# Altium schematic sheet opa.SchDoc
size A3
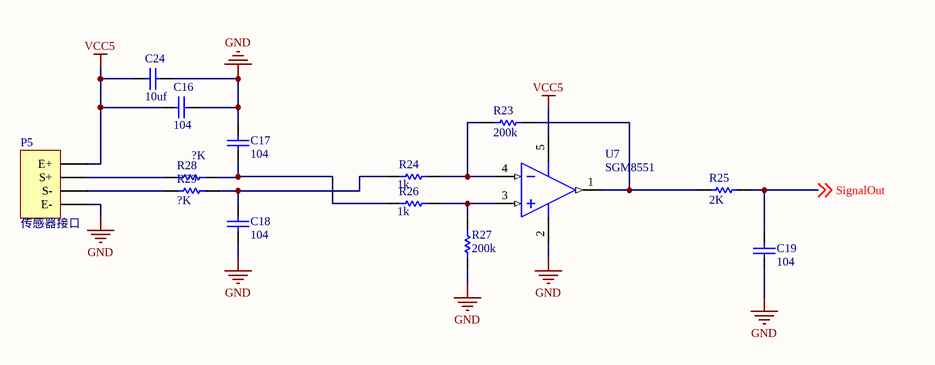
[diagram p0: opa.SchDoc]

## Parts
C16  value 104  [C0805]  (hidden comment: Cap)
C17  value 104  [C0805]  (hidden comment: Cap)
C18  value 104  [C0805]  (hidden comment: Cap)
C19  value 104  [C0805]  (hidden comment: Cap)
C24  value 10uf  [C0805]  (hidden comment: Cap)
P5  传感器接口  [HDR1X4]
R23  value 200k  [6-0805_N]  (hidden comment: Res1)
R24  value 1k  [6-0805_N]  (hidden comment: Res1)
R25  value 2K  [6-0805_N]  (hidden comment: Res1)
R26  value 1k  [6-0805_N]  (hidden comment: Res1)
R27  value 200k  [6-0805_N]  (hidden comment: Res1)
R28  value ?K  [6-0805_N]  (hidden comment: Res1)
R29  value ?K  [6-0805_N]  (hidden comment: Res1)
U7  SGM8551  [SOT23-5_N]

## Nets
GND: C16.1 C17.2 C18.1 C19.1 C24.1 P5.4(E-) R27.1 U7.2(VEE)
VCC5: C16.2 C24.2 P5.1(E+) U7.5(VCC)
SignalOut: C19.2 R25.1 ; off-sheet SignalOut
NetC17_1: C17.1 R26.1 R28.1
NetC18_2: C18.2 R24.1 R29.1
NetP5_2: P5.2(S+) R28.2
NetP5_3: P5.3(S-) R29.2
NetR23_1: R23.1 R25.2 U7.1(OUT)
NetR23_2: R23.2 R24.2 U7.4(IN-)
NetR26_2: R26.2 R27.2 U7.3(IN+)

## Library data of the parts
C16-C19 C24 = Cap: Capacitor; Published: 8-Jun-2000; LatestRevisionDate: 17-Jul-2002; LatestRevisionNote: Re-released for DXP Platform.; PackageReference: RAD-0.3; Publisher: Altium Limited; PackageDescription: Radial Cap, Thru-Hole; 2 Leads; 0.3 in Pin Spacing
P5 = Header 4: Header, 4-Pin; LatestRevisionDate: 17-Jul-2002; LatestRevisionNote: Re-released for DXP Platform.; Publisher: Altium Limited
R23-R29 = Res1: Resistor; Published: 8-Jun-2000; LatestRevisionDate: 17-Jul-2002; LatestRevisionNote: Re-released for DXP Platform.; PackageReference: AXIAL-0.3; Publisher: Altium Limited; PackageDescription: Axial Device, Thru-Hole; 2 Leads; 0.3 in Pin Spacing
U7 = MAX4214EUK-T: High-Speed, Single-Supply, Gain of +2, Closed-Loop, Rail-to-Rail Buffer with Enable; Published: 23-Sep-2002; LatestRevisionDate: 29-May-2009; LatestRevisionNote: IPC-7351 Footprint Added.; DatasheetVersion: Rev 0; 12/97; PackageVersion: revE, 2004; PackageReference: SOT23-5; Publisher: Altium Limited; PackageDescription: 5-Pin SOT-23 Package 0.95 mm Pitch, 2.8 mm Lead Span; Code_JEITA: SC-74A; Code_IPC: SOT23-5; ComponentLink1Description: Manufacturer Link; ComponentLink1URL: http://www.maxim-ic.com/; ComponentLink2Description: Datasheet; ComponentLink2URL: http://pdfserv.maxim-ic.com/en/ds/MAX4214-MAX4222.pdf